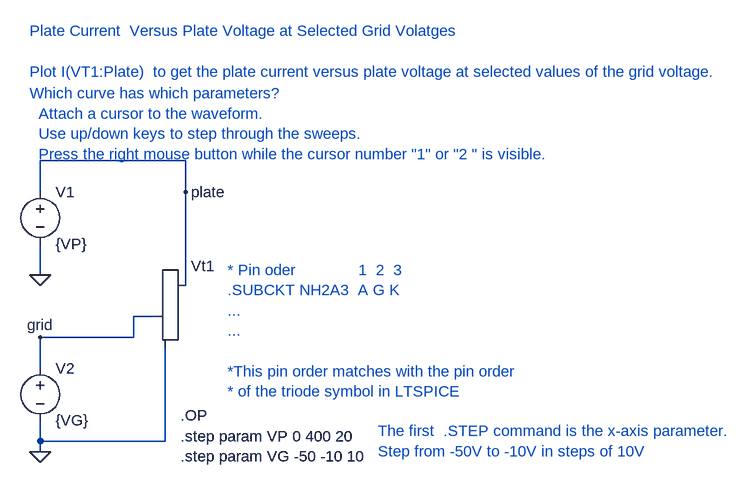
[diagram p0: schematic Triode_plate_current1.asc]
Triode_plate_current1.asc, the LTspice schematic file:
Version 4
SHEET 1 1560 724
WIRE 128 128 -96 128
WIRE -96 176 -96 128
WIRE 128 176 128 128
WIRE -96 304 -96 256
WIRE 128 320 128 176
WIRE 80 368 48 368
WIRE 48 400 48 368
WIRE 48 400 -96 400
WIRE -96 448 -96 400
WIRE -96 560 -96 528
WIRE 96 560 96 416
WIRE 96 560 -96 560
WIRE -96 576 -96 560
FLAG -96 576 0
FLAG -96 304 0
FLAG 128 176 plate
FLAG -96 400 grid
SYMBOL voltage -96 432 R0
WINDOW 123 24 132 Left 0
WINDOW 39 0 0 Left 0
SYMATTR InstName V2
SYMATTR Value {VG}
SYMBOL voltage -96 160 R0
WINDOW 123 24 132 Left 0
WINDOW 39 0 0 Left 0
SYMATTR InstName V1
SYMATTR Value {VP}
SYMBOL Valve\\triode 128 368 R0
SYMATTR InstName Vt1
SYMATTR SpiceModel NH2A3
TEXT 120 552 Left 0 !.step param VP 0 400 20\n.step param VG -50 -10 10
TEXT 120 520 Left 0 !.OP
TEXT -112 -72 Left 0 ;Plate Current  Versus Plate Voltage at Selected Grid Volatges\n \nPlot I(VT1:Plate)  to get the plate current versus plate voltage at selected values of the grid voltage.
TEXT 424 544 Left 0 ;The first  .STEP command is the x-axis parameter.\nStep from -50V to -10V in steps of 10V
TEXT 192 296 Left 0 ;* Pin oder              1  2  3\n.SUBCKT NH2A3  A G K\n... \n...\n \n*This pin order matches with the pin order \n* of the triode symbol in LTSPICE
TEXT -112 24 Left 0 ;Which curve has which parameters?\n  Attach a cursor to the waveform.\n  Use up/down keys to step through the sweeps.\n  Press the right mouse button while the cursor number "1" or "2 " is visible.

The netlist it stands for:
* Triode_plate_current1.asc
V2 grid 0 {VG}
V1 plate 0 {VP}
XVt1 plate grid 0 NH2A3
.step param VP 0 400 20
.step param VG -50 -10 10
.OP
* Plate Current  Versus Plate Voltage at Selected Grid Volatges
* Plot I(VT1:Plate)  to get the plate current versus plate voltage at selected values of the grid voltage.
* The first  .STEP command is the x-axis parameter.
* Step from -50V to -10V in steps of 10V
* * Pin oder              1  2  3
* .SUBCKT NH2A3  A G K
* ...
* ...
* *This pin order matches with the pin order
* * of the triode symbol in LTSPICE
* Which curve has which parameters?
*   Attach a cursor to the waveform.
*   Use up/down keys to step through the sweeps.
*   Press the right mouse button while the cursor number "1" or "2 " is visible.
.backanno
.end